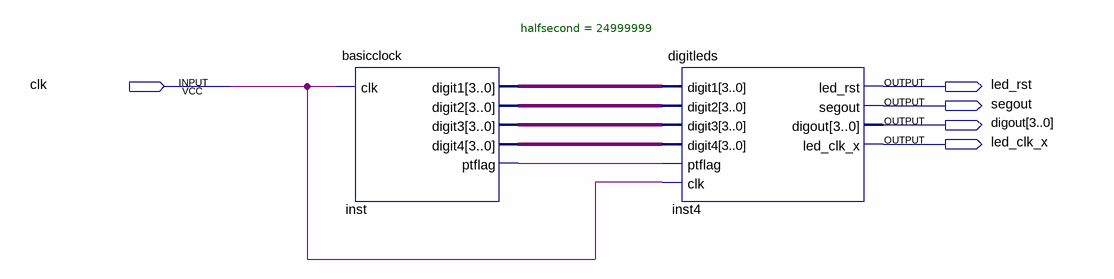
[diagram p0: schematic sheet]
// Quartus schematic rtc.bdf as structural Verilog: 2 symbols, 5 pins
module rtc (
  input  clk,
  output led_rst,
  output segout,
  output [3:0] digout,
  output led_clk_x
);

  wire inst_ptflag;
  wire [3:0] inst_digit1, inst_digit2, inst_digit3, inst_digit4;

  basicclock #(.halfsecond(24999999)) inst (
    .clk(clk), .digit1(inst_digit1), .digit2(inst_digit2), .digit3(inst_digit3), .digit4(inst_digit4),
    .ptflag(inst_ptflag));
  digitleds inst4 (
    .digit1(inst_digit1), .digit2(inst_digit2), .digit3(inst_digit3), .digit4(inst_digit4),
    .ptflag(inst_ptflag), .clk(clk), .led_rst(led_rst), .segout(segout), .digout(digout),
    .led_clk_x(led_clk_x));
endmodule
